# EAGLE board MDCBoard (EAGLE 9.6.2), part 1 of 2
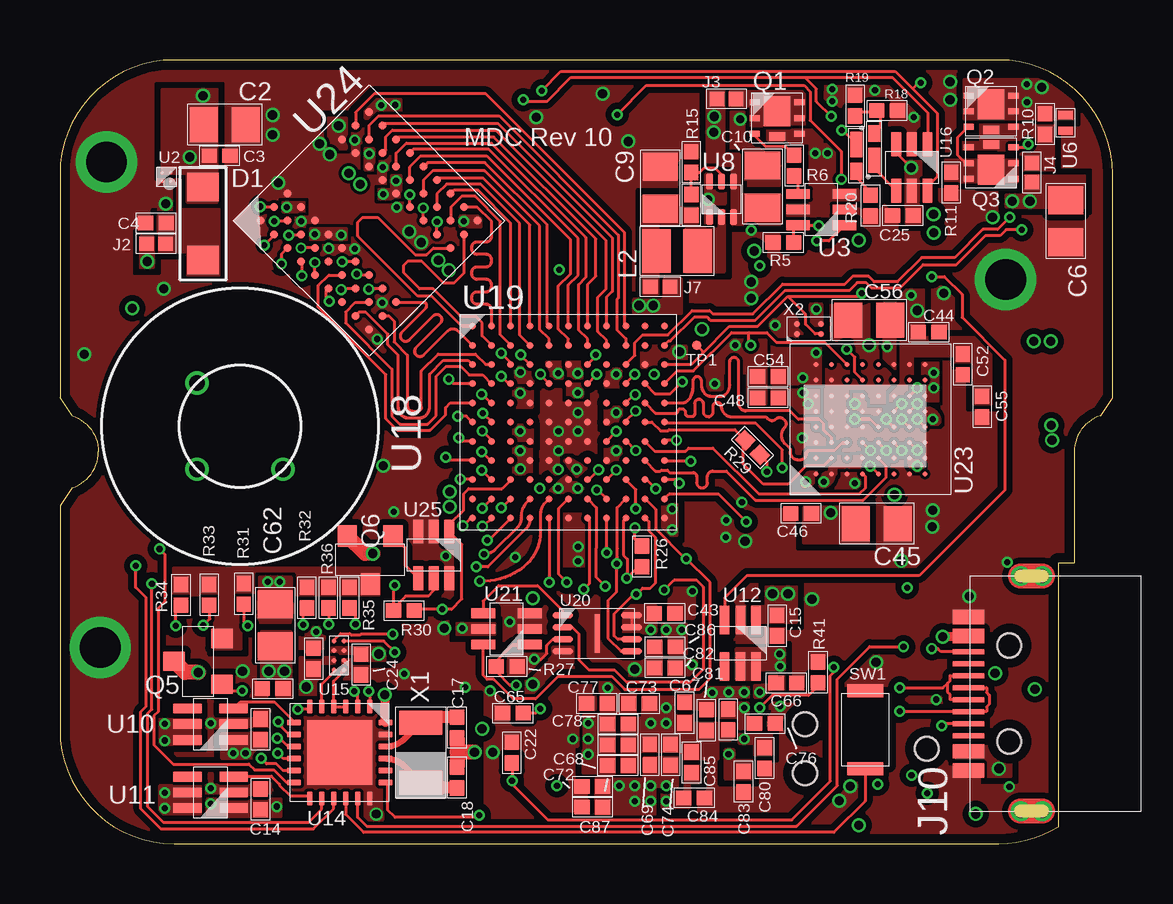
[diagram p12: board, top side]
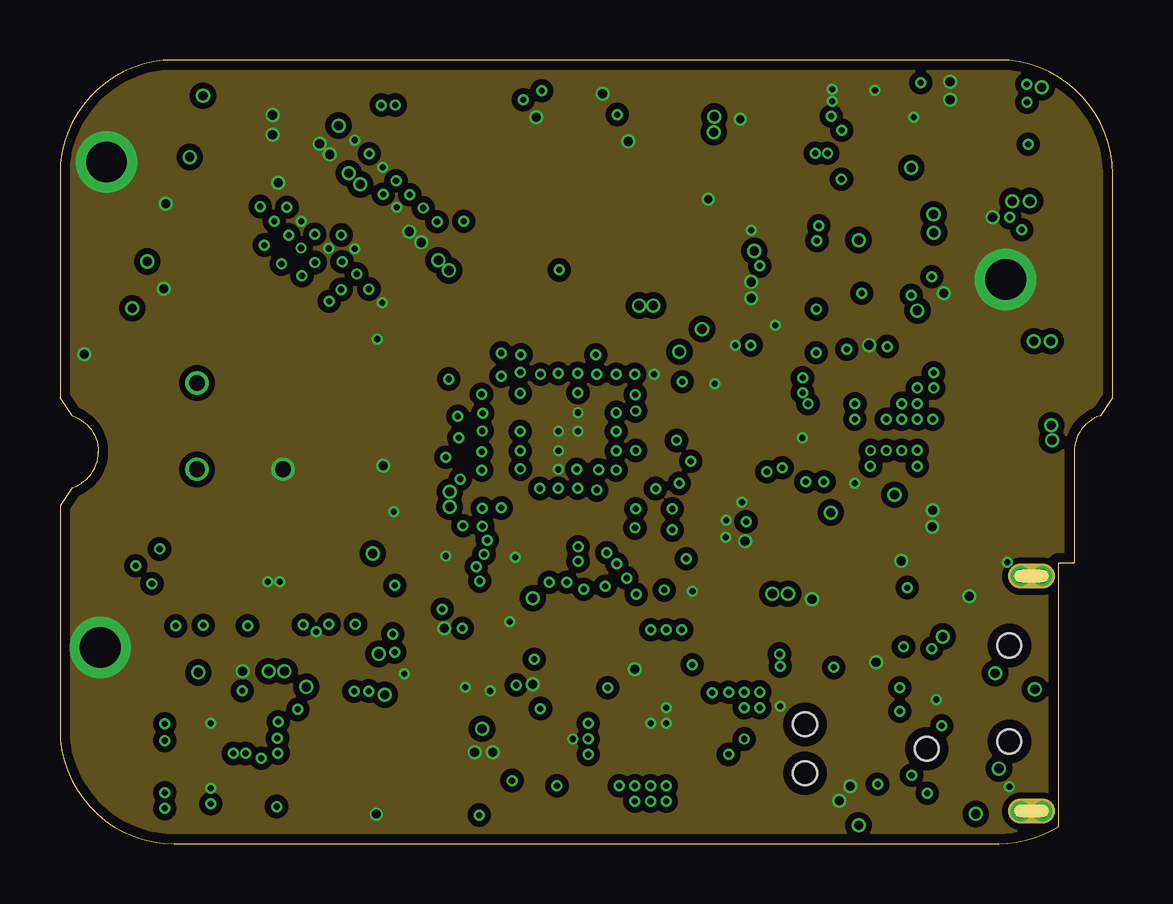
[diagram p13: board, inner layer Ground]
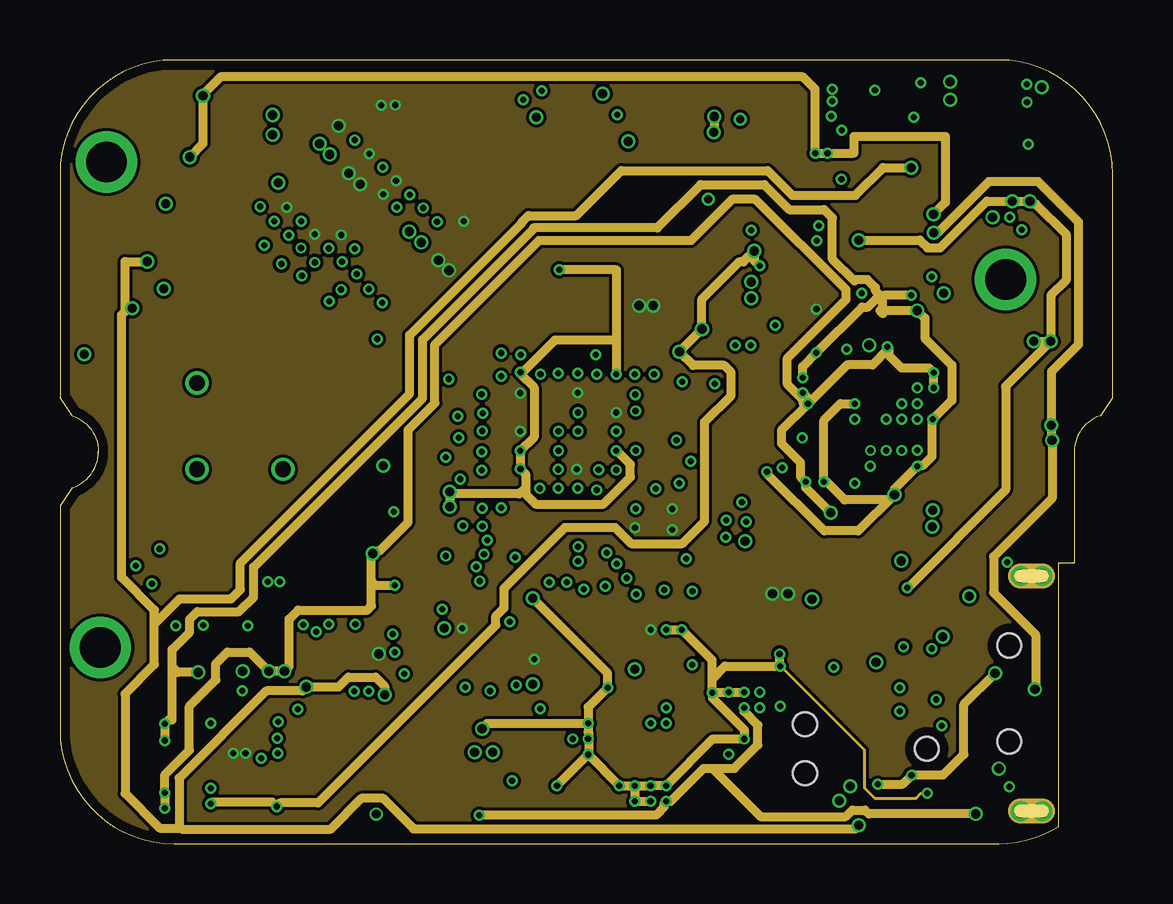
[diagram p14: board, inner layer Power]
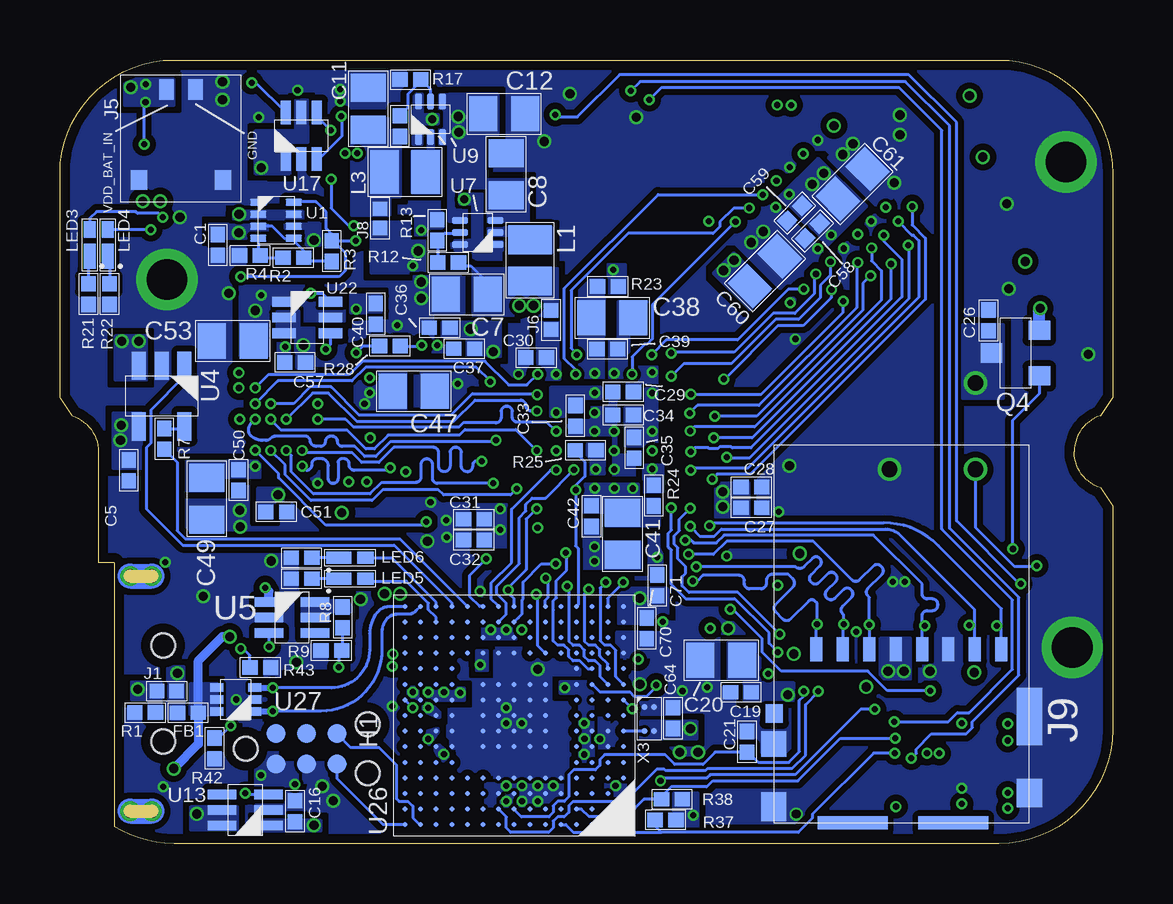
[diagram p15: board, bottom side, seen from below]

Size 43.85 x 32.65 mm. Coordinates in mm from the lower left corner, seen from the top.
Outline: 0,18.57 0,27.9 arc-90 4.75,32.65 39.1,32.65 arc-90 43.85,27.9 43.85,18.57
Outline: 0,14.07 0,4.75 arc90 4.75,0 39.1,0 arc32 41.6,0.71 41.6,0.8
Outline: 42.26,16.32 42.26,11.7 41.6,11.7
Copper layers (1*2*15*16): Top 0.035559375mm / dielectric 0.17018125mm / Ground 0.01778125mm / dielectric 47mil / Power 0.01778125mm / dielectric 0.17018125mm / Bottom 0.035559375mm
Design rules "DRC-Generic-4Layer": minimum track width 5mil, minimum drill 10mil, track to track 5mil, track to pad 6mil, pad to pad 6mil, via to via 6mil, smd to smd 5mil, copper to edge 16mil, drill to drill 6mil, minimum pad ring 4mil, minimum via ring 4mil, stop-mask expansion 2.5mil, vias tented up to drill 25mil, thermal gap 10mil
tKeepout: area 26.9,10.8 to 40.2,24; area 31.7,3 to 35.3,6.5

## Footprints (pad centres in the part's own frame; a part is rotated, then mirrored left to right if it is on the bottom)
0402 = smd 0.635 x 0.6: 1 -0.432,0; 2 0.432,0
0805 = smd 1.165 x 1.465: 1 -0.875,0; 2 0.875,0
ROHM-SOD-123FL = smd 1.195 x 1.312: A 1.525,0; C -1.525,0
TAGCONNECT-TC2030-NL = smd 0.787 x 0.787: 1 -1.27,-0.635; 2 -1.27,0.635; 3 0,-0.635; 4 0,0.635; 5 1.27,-0.635; 6 1.27,0.635 | hole 0.991: -2.54,0; 2.54,1.016; 2.54,-1.016
JUMPER-SOLDER-CLOSED = smd 0.6 x 0.6: 1 -0.4,0; 2 0.4,0
MOLEX-781710002 = smd 0.6 x 0.85: 1 -0.6,0; 2 0.6,0 | smd 0.7 x 0.8: 3 1.75,-3.775; 4 -1.75,-3.775
MOLEX-1051620001 = smd 0.5 x 1: CLK -0.85,0.632; CMD 1.35,0.632; DAT0 -3.05,0.632; DAT1 -4.15,0.632; DAT2 3.55,0.632; DAT3 2.45,0.632; VDD 0.25,0.632; VSS -1.95,0.632 | smd 0.72 x 0.78: DET 5.31,3.312 | smd 1.05 x 1.08: GND1 5.325,4.582 | smd 1.05 x 1.2: GND2 5.325,7.192; GND3 -5.325,6.622 | smd 1.05 x 2.39: GND4 -5.325,3.438 | smd 2.91 x 0.55: NC1 -2.145,7.867; NC2 2.045,7.867
GSWITCH-GT-USB-7030A = smd 0.2 x 1.3: A5 1.25,-3.85; A6 0.25,-3.85; A7 -0.25,-3.85; A8 -1.25,-3.85; B5 -1.75,-3.85; B6 -0.75,-3.85; B7 0.75,-3.85; B8 1.75,-3.85 | smd 0.6 x 1.3: A9B4 -2.4,-3.85; A12B1 -3.2,-3.85; B9A4 2.4,-3.85; B12A1 3.2,-3.85 | drill 0.55: GND1 -4.9,-0.775; GND2 -4.9,-1.675; GND3 4.9,-0.775; GND4 4.9,-1.675 | hole 1: -2,-2.15; 2,-2.15
0806 = smd 1.196 x 1.815: 1 -0.86,0; 2 0.86,0
OSRAM-TOPLED-E1608 = smd 1.05 x 0.5: A 0.325,0 | smd 0.7 x 0.5: C -0.79,0
LED-0603 = smd 0.7 x 0.5: A 0.641,0 | smd 1.05 x 0.5: C -0.475,0
MDC-MOUNT-HOLE = drill 1.7: 1 0,0
NEXPERIA-SOT1220 = smd 0.43 x 0.25: 1 -0.935,0.65; 2 -0.935,0; 3 -0.935,-0.65; 4 0.935,-0.65; 5 0.935,0; 6 0.935,0.65 | smd 1.1 x 1.25: 7 0,0.285 | smd 0.66 x 0.35: 8 0,-0.775
DIODESINC-DMG2305UX = smd 0.9 x 0.8: D 1,0; G -1,0.95; S -1,-0.95
DEALON-TD-1624UR-180 = smd 0.55 x 1.5: 1 -1.625,0; 2 1.625,0
TEST-POINT = smd 0.4 x 0.4: X 0,0
TI-TPS2116DRLR = smd 0.67 x 0.3: 1 -0.74,0.75; 2 -0.74,0.25; 3 -0.74,-0.25; 4 -0.74,-0.75; 5 0.74,-0.75; 6 0.74,-0.25; 7 0.74,0.25; 8 0.74,0.75
DIODESINC-AP7350 = smd 0.15 x 0.15: 1 -0.175,0.175; 2 -0.175,-0.175; 3 0.175,-0.175; 4 0.175,0.175
NEXPERIA-SOT363 = smd 0.988 x 0.41: 1 -0.97,0.65; 2 -0.97,0; 3 -0.97,-0.65; 4 0.97,-0.65; 5 0.97,0; 6 0.97,0.65
MICROCHIP-MIC550X-SOT23-5 = smd 1.186 x 0.584: 1 -1.264,0.95; 2 -1.264,0; 3 -1.264,-0.95; 4 1.264,-0.95; 5 1.264,0.95
TI-TPS22919DCK = smd 1.186 x 0.397: 1 -0.962,0.65; 2 -0.962,0; 3 -0.962,-0.65; 4 0.962,-0.65; 5 0.962,0; 6 0.962,0.65
EATON-STN101 = smd 0.35 x 0.6: 1 -0.325,0; 2 0.325,0
TI-TPS62A01DRLR = smd 0.67 x 0.3: 1 -0.74,0.5; 2 -0.74,0; 3 -0.74,-0.5; 4 0.74,-0.5; 5 0.74,0; 6 0.74,0.5
TI-MSP430FR2433IRGE = smd 0.58 x 0.24: 1 -1.913,1.25; 2 -1.913,0.75; 3 -1.913,0.25; 4 -1.913,-0.25; 5 -1.913,-0.75; 6 -1.913,-1.25; 13 1.913,-1.25; 14 1.913,-0.75; 15 1.913,-0.25; 16 1.913,0.25; 17 1.913,0.75; 18 1.913,1.25 | smd 0.24 x 0.58: 7 -1.25,-1.913; 8 -0.75,-1.913; 9 -0.25,-1.913; 10 0.25,-1.913; 11 0.75,-1.913; 12 1.25,-1.913; 19 1.25,1.913; 20 0.75,1.913; 21 0.25,1.913; 22 -0.25,1.913; 23 -0.75,1.913; 24 -1.25,1.913 | smd 2.7 x 2.7: 25 0,0
NEXPERIA-NXB0102UN = smd 0.2 x 0.2: A1 -0.2,0.6; A2 0.2,0.6; B1 -0.2,0.2; B2 0.2,0.2; C1 -0.2,-0.2; C2 0.2,-0.2; D1 -0.2,-0.6; D2 0.2,-0.6
PANASONIC-EKMB110711X = drill 0.65: 1 2.54,0; 2 0,2.54; 3 -2.54,0
LATTICE-ICE40HX4K-BG121 = smd 0.3 x 0.3: A1 -4,4; A2 -3.2,4; A3 -2.4,4; A4 -1.6,4; A5 -0.8,4; A6 0,4; A7 0.8,4; A8 1.6,4; A9 2.4,4; A10 3.2,4; A11 4,4; B1 -4,3.2; B2 -3.2,3.2; B3 -2.4,3.2; B4 -1.6,3.2; B5 -0.8,3.2; B6 0,3.2; B7 0.8,3.2; B8 1.6,3.2; B9 2.4,3.2; B10 3.2,3.2; B11 4,3.2; C1 -4,2.4; C2 -3.2,2.4; C3 -2.4,2.4; C4 -1.6,2.4; C5 -0.8,2.4; C6 0,2.4; C7 0.8,2.4; C8 1.6,2.4; C9 2.4,2.4; C10 3.2,2.4; C11 4,2.4; D1 -4,1.6; D2 -3.2,1.6; D3 -2.4,1.6; D4 -1.6,1.6; D5 -0.8,1.6; D6 0,1.6; D7 0.8,1.6; D8 1.6,1.6; D9 2.4,1.6; D10 3.2,1.6; D11 4,1.6; E1 -4,0.8; E2 -3.2,0.8; E3 -2.4,0.8; E4 -1.6,0.8; E5 -0.8,0.8; E6 0,0.8; E7 0.8,0.8; E8 1.6,0.8; E9 2.4,0.8; E10 3.2,0.8; E11 4,0.8; F1 -4,0; F2 -3.2,0; F3 -2.4,0; F4 -1.6,0; F5 -0.8,0; F6 0,0; F7 0.8,0; F8 1.6,0; F9 2.4,0; F10 3.2,0; F11 4,0; G1 -4,-0.8; G2 -3.2,-0.8; G3 -2.4,-0.8; G4 -1.6,-0.8; G5 -0.8,-0.8; G6 0,-0.8; G7 0.8,-0.8; G8 1.6,-0.8; G9 2.4,-0.8; G10 3.2,-0.8; G11 4,-0.8; H1 -4,-1.6; H2 -3.2,-1.6; H3 -2.4,-1.6; H4 -1.6,-1.6; H5 -0.8,-1.6; H6 0,-1.6; H7 0.8,-1.6; H8 1.6,-1.6; H9 2.4,-1.6; H10 3.2,-1.6; H11 4,-1.6; J1 -4,-2.4; J2 -3.2,-2.4; J3 -2.4,-2.4; J4 -1.6,-2.4; J5 -0.8,-2.4; J6 0,-2.4; J7 0.8,-2.4; J8 1.6,-2.4; J9 2.4,-2.4; J10 3.2,-2.4; J11 4,-2.4; K1 -4,-3.2; K2 -3.2,-3.2; K3 -2.4,-3.2; K4 -1.6,-3.2; K5 -0.8,-3.2; K6 0,-3.2; K7 0.8,-3.2; K8 1.6,-3.2; K9 2.4,-3.2; K10 3.2,-3.2; K11 4,-3.2; L1 -4,-4; L2 -3.2,-4; L3 -2.4,-4; L4 -1.6,-4; L5 -0.8,-4; L6 0,-4; L7 0.8,-4; L8 1.6,-4; L9 2.4,-4; L10 3.2,-4; L11 4,-4
WINBOND-W25Q40EWUXIE = smd 0.86 x 0.27: 1 -1.435,0.75; 2 -1.435,0.25; 3 -1.435,-0.25; 4 -1.435,-0.75; 5 1.435,-0.75; 6 1.435,-0.25; 7 1.435,0.25; 8 1.435,0.75 | smd 0.2 x 1.6: 9 0,0
ON-AR0330CS1C12SPKA0 = smd 0.2 x 0.2: A1 -1.985,2.045; A2 -1.335,2.045; A3 -0.685,2.045; A4 -0.035,2.045; A5 0.615,2.045; A6 1.265,2.045; A7 1.915,2.045; A8 2.565,2.045; B1 -1.985,1.395; B2 -1.335,1.395; B3 -0.685,1.395; B4 -0.035,1.395; B5 0.615,1.395; B6 1.265,1.395; B7 1.915,1.395; B8 2.565,1.395; C1 -1.985,0.745; C2 -1.335,0.745; C3 -0.685,0.745; C4 -0.035,0.745; C5 0.615,0.745; C6 1.265,0.745; C7 1.915,0.745; C8 2.565,0.745; D1 -1.985,0.095; D2 -1.335,0.095; D3 -0.685,0.095; D4 -0.035,0.095; D5 0.615,0.095; D6 1.265,0.095; D7 1.915,0.095; D8 2.565,0.095; E1 -1.985,-0.555; E2 -1.335,-0.555; E3 -0.685,-0.555; E4 -0.035,-0.555; E5 0.615,-0.555; E6 1.265,-0.555; E7 1.915,-0.555; E8 2.565,-0.555; F1 -1.985,-1.205; F2 -1.335,-1.205; F3 -0.685,-1.205; F4 -0.035,-1.205; F5 0.615,-1.205; F6 1.265,-1.205; F7 1.915,-1.205; F8 2.565,-1.205; G1 -1.985,-1.855; G2 -1.335,-1.855; G3 -0.685,-1.855; G4 -0.035,-1.855; G5 0.615,-1.855; G6 1.265,-1.855; G7 1.915,-1.855; G8 2.565,-1.855; H1 -1.985,-2.505; H2 -1.335,-2.505; H3 -0.685,-2.505; H4 -0.035,-2.505; H5 0.615,-2.505; H6 1.265,-2.505; H7 1.915,-2.505; H8 2.565,-2.505
ALLIANCE-AS4C8M16MSA-6BIN = smd 0.33 x 0.33: A1 -3.2,3.2; A2 -2.4,3.2; A3 -1.6,3.2; A7 1.6,3.2; A8 2.4,3.2; A9 3.2,3.2; B1 -3.2,2.4; B2 -2.4,2.4; B3 -1.6,2.4; B7 1.6,2.4; B8 2.4,2.4; B9 3.2,2.4; C1 -3.2,1.6; C2 -2.4,1.6; C3 -1.6,1.6; C7 1.6,1.6; C8 2.4,1.6; C9 3.2,1.6; D1 -3.2,0.8; D2 -2.4,0.8; D3 -1.6,0.8; D7 1.6,0.8; D8 2.4,0.8; D9 3.2,0.8; E1 -3.2,0; E2 -2.4,0; E3 -1.6,0; E7 1.6,0; E8 2.4,0; E9 3.2,0; F1 -3.2,-0.8; F2 -2.4,-0.8; F3 -1.6,-0.8; F7 1.6,-0.8; F8 2.4,-0.8; F9 3.2,-0.8; G1 -3.2,-1.6; G2 -2.4,-1.6; G3 -1.6,-1.6; G7 1.6,-1.6; G8 2.4,-1.6; G9 3.2,-1.6; H1 -3.2,-2.4; H2 -2.4,-2.4; H3 -1.6,-2.4; H7 1.6,-2.4; H8 2.4,-2.4; H9 3.2,-2.4; J1 -3.2,-3.2; J2 -2.4,-3.2; J3 -1.6,-3.2; J7 1.6,-3.2; J8 2.4,-3.2; J9 3.2,-3.2
STM-STM32F730I8 = smd 0.2 x 0.2: A1 -4.55,4.55; A2 -3.9,4.55; A3 -3.25,4.55; A4 -2.6,4.55; A5 -1.95,4.55; A6 -1.3,4.55; A7 -0.65,4.55; A8 0,4.55; A9 0.65,4.55; A10 1.3,4.55; A11 1.95,4.55; A12 2.6,4.55; A13 3.25,4.55; A14 3.9,4.55; A15 4.55,4.55; B1 -4.55,3.9; B2 -3.9,3.9; B3 -3.25,3.9; B4 -2.6,3.9; B5 -1.95,3.9; B6 -1.3,3.9; B7 -0.65,3.9; B8 0,3.9; B9 0.65,3.9; B10 1.3,3.9; B11 1.95,3.9; B12 2.6,3.9; B13 3.25,3.9; B14 3.9,3.9; B15 4.55,3.9; C1 -4.55,3.25; C2 -3.9,3.25; C3 -3.25,3.25; C4 -2.6,3.25; C5 -1.95,3.25; C6 -1.3,3.25; C7 -0.65,3.25; C8 0,3.25; C9 0.65,3.25; C10 1.3,3.25; C11 1.95,3.25; C12 2.6,3.25; C13 3.25,3.25; C14 3.9,3.25; C15 4.55,3.25; D1 -4.55,2.6; D2 -3.9,2.6; D3 -3.25,2.6; D4 -2.6,2.6; D5 -1.95,2.6; D6 -1.3,2.6; D7 -0.65,2.6; D8 0,2.6; D9 0.65,2.6; D10 1.3,2.6; D11 1.95,2.6; D12 2.6,2.6; D13 3.25,2.6; D14 3.9,2.6; D15 4.55,2.6; E1 -4.55,1.95; E2 -3.9,1.95; E3 -3.25,1.95; E4 -2.6,1.95; E12 2.6,1.95; E13 3.25,1.95; E14 3.9,1.95; E15 4.55,1.95; F1 -4.55,1.3; F2 -3.9,1.3; F3 -3.25,1.3; F4 -2.6,1.3; F6 -1.3,1.3; F7 -0.65,1.3; F8 0,1.3; F9 0.65,1.3; F10 1.3,1.3; F12 2.6,1.3; F13 3.25,1.3; F14 3.9,1.3; F15 4.55,1.3; G1 -4.55,0.65; G2 -3.9,0.65; G3 -3.25,0.65; G4 -2.6,0.65; G6 -1.3,0.65; G7 -0.65,0.65; G8 0,0.65; G9 0.65,0.65; G10 1.3,0.65; G12 2.6,0.65; G13 3.25,0.65; G14 3.9,0.65; G15 4.55,0.65; H1 -4.55,0; H2 -3.9,0; H3 -3.25,0; H4 -2.6,0; H6 -1.3,0; H7 -0.65,0; H8 0,0; H9 0.65,0; H10 1.3,0; H12 2.6,0; H13 3.25,0; H14 3.9,0; H15 4.55,0; J1 -4.55,-0.65; J2 -3.9,-0.65; J3 -3.25,-0.65; J4 -2.6,-0.65; J6 -1.3,-0.65; J7 -0.65,-0.65; J8 0,-0.65; J9 0.65,-0.65; J10 1.3,-0.65; J12 2.6,-0.65; J13 3.25,-0.65; J14 3.9,-0.65; J15 4.55,-0.65; K1 -4.55,-1.3; K2 -3.9,-1.3; K3 -3.25,-1.3; K4 -2.6,-1.3; K6 -1.3,-1.3; K7 -0.65,-1.3; K8 0,-1.3; K9 0.65,-1.3; K10 1.3,-1.3; K12 2.6,-1.3; K13 3.25,-1.3; K14 3.9,-1.3; K15 4.55,-1.3; L1 -4.55,-1.95; L2 -3.9,-1.95; L3 -3.25,-1.95; L4 -2.6,-1.95; L12 2.6,-1.95; L13 3.25,-1.95; L14 3.9,-1.95; L15 4.55,-1.95; M1 -4.55,-2.6; M2 -3.9,-2.6; M3 -3.25,-2.6; M4 -2.6,-2.6; M5 -1.95,-2.6; M6 -1.3,-2.6; M7 -0.65,-2.6; M8 0,-2.6; M9 0.65,-2.6; M10 1.3,-2.6; M11 1.95,-2.6; M12 2.6,-2.6; M13 3.25,-2.6; M14 3.9,-2.6; M15 4.55,-2.6; N1 -4.55,-3.25; N2 -3.9,-3.25; N3 -3.25,-3.25; N4 -2.6,-3.25; N5 -1.95,-3.25; N6 -1.3,-3.25; N7 -0.65,-3.25; N8 0,-3.25; N9 0.65,-3.25; N10 1.3,-3.25; N11 1.95,-3.25; N12 2.6,-3.25; N13 3.25,-3.25; N14 3.9,-3.25; N15 4.55,-3.25; P1 -4.55,-3.9; P2 -3.9,-3.9; P3 -3.25,-3.9; P4 -2.6,-3.9; P5 -1.95,-3.9; P6 -1.3,-3.9; P7 -0.65,-3.9; P8 0,-3.9; P9 0.65,-3.9; P10 1.3,-3.9; P11 1.95,-3.9; P12 2.6,-3.9; P13 3.25,-3.9; P14 3.9,-3.9; P15 4.55,-3.9; R1 -4.55,-4.55; R2 -3.9,-4.55; R3 -3.25,-4.55; R4 -2.6,-4.55; R5 -1.95,-4.55; R6 -1.3,-4.55; R7 -0.65,-4.55; R8 0,-4.55; R9 0.65,-4.55; R10 1.3,-4.55; R11 1.95,-4.55; R12 2.6,-4.55; R13 3.25,-4.55; R14 3.9,-4.55; R15 4.55,-4.55
DIODESINC-DT1446-04V-7 = smd 0.546 x 0.337: 1 -0.796,0.5; 2 -0.796,0; 3 -0.796,-0.5; 4 0.796,-0.5; 5 0.796,0; 6 0.796,0.5
EPSON-FC-135 = smd 1 x 1.8: 1 -1.25,0; 2 1.25,0
SITIME-SIT8021 = smd 0.25 x 0.25: 1 -0.205,0.5; 2 -0.205,-0.5; 3 0.205,-0.5; 4 0.205,0.5

## Placement (x,y rotation side)
C1  2.2u  [0402]  37.28,24.94 270 bottom
C2  10u  [0805]  6.86,29.96 0 top
C3  100n  [0402]  6.65,28.66 0 top
C4  100n  [0402]  4,25.86 180 top
C5  2.2u  [0402]  40.99,15.55 270 bottom
C6  10u  [0805]  41.9,25.94 270 top
C7  22u  [0805]  26.91,22.88 180 bottom
C8  10u  [0805]  25.27,27.89 90 bottom
C9  22u  [0805]  25.01,27.32 90 top
C10  10u  [0805]  29.27,27.38 90 top
C11  22u  [0805]  31.01,30.62 90 bottom
C12  10u  [0805]  25.35,30.41 0 bottom
C13  2.2u  [0402]  8.36,4.76 90 top
C14  2.2u  [0402]  8.35,1.85 90 top
C15  2.2u  [0402]  29.88,9.08 270 top
C16  2.2u  [0402]  34.06,1.35 90 bottom
C17  22p  [0402]  16.54,4.83 270 top
C18  22p  [0402]  16.54,2.75 90 top
C19  100n  [0402]  15.48,6.3 180 bottom
C20  10u  [0805]  16.3,7.64 180 bottom
C21  22p  [0402]  15.23,4.24 90 bottom
C22  100n  [0402]  18.82,3.79 90 top
C23  100n  [0402]  10.57,7.7 90 top
C24  100n  [0402]  12.55,7.46 270 top
C25  100n  [0402]  35.12,26.17 180 top
C26  100n  [0402]  5.17,21.8 90 bottom
C27  100n  [0402]  15.05,13.99 0 bottom
C28  10n  [0402]  15.05,14.86 0 bottom
C29  100n  [0402]  20.39,18.82 180 bottom
C30  10n  [0402]  24.01,20.25 180 bottom
C31  100n  [0402]  26.61,13.52 180 bottom
C32  10n  [0402]  26.61,12.65 180 bottom
C33  10n  [0402]  22.38,17.82 270 bottom
C34  100n  [0402]  20.39,17.86 180 bottom
C35  10n  [0402]  19.93,16.49 270 bottom
C36  100n  [0402]  28.04,21.49 180 bottom
C37  10n  [0402]  27.01,20.62 180 bottom
C38  10u  [0805]  20.85,21.91 0 bottom
C39  100n  [0402]  21.04,20.6 0 bottom
C40  10n  [0402]  30.7,22.08 270 bottom
C41  10u  [0805]  20.41,12.9 270 bottom
C42  100n  [0402]  21.71,13.64 270 bottom
C43  100n  [0402]  25.19,9.6 0 top
C44  100n  [0402]  36.2,21.31 0 top
C45  10u  [0805]  34.03,13.33 0 top
C46  100n  [0402]  30.88,13.76 180 top
C47  10u  [0805]  29.11,18.85 0 bottom
C48  100n  [0402]  29.5,18.57 180 top
C49  10u  [0805]  37.74,14.38 270 bottom
C50  100n  [0402]  36.41,15.15 270 bottom
C51  100n  [0402]  34.84,13.82 0 bottom
C52  100n  [0402]  37.61,19.97 270 top
C53  10u  [0805]  36.66,20.94 180 bottom
C54  100n  [0402]  29.5,19.46 180 top
C55  100n  [0402]  38.42,18.2 270 top
C56  10u  [0805]  33.72,21.81 180 top
C57  100n  [0402]  34.06,20.05 0 bottom
C58  100n  [0402]  12.5,25.53 225 bottom
C59  100n  [0402]  13.24,26.27 225 bottom
C60  10u  [0805]  14.48,23.85 45 bottom
C61  10u  [0805]  10.83,27.49 45 bottom
C62  10u  [0805]  8.97,9.09 90 top
C63  100n  [0402]  8.86,6.46 180 top
C64  10n  [0402]  18.31,5.22 90 bottom
C65  100n  [0402]  18.87,5.43 180 top
C66  2.2u  [0402]  30.26,6.69 0 top
C67  100n  [0402]  26.02,5.46 270 top
C68  100n  [0402]  23.24,3.26 0 top
C69  100n  [0402]  24.57,3.71 90 top
C70  100n  [0402]  19.41,8.97 270 bottom
C71  2.2u  [0402]  18.97,10.76 90 bottom
C72  100n  [0402]  22.18,2.38 180 top
C73  100n  [0402]  24.13,5.84 0 top
C74  100n  [0402]  25.45,3.7 90 top
C75  100n  [0402]  27.84,5.17 270 top
C76  2.2u  [0402]  29.37,5 0 top
C77  100n  [0402]  22.37,5.84 180 top
C78  100n  [0402]  23.25,4.98 0 top
C79  100n  [0402]  23.25,4.12 0 top
C80  100n  [0402]  29.35,3.56 270 top
C81  100n  [0402]  26.93,5.14 270 top
C82  2.2u  [0402]  25.21,7.32 180 top
C83  2.2u  [0402]  28.48,2.59 270 top
C84  100n  [0402]  26.43,1.91 0 top
C85  2.2u  [0402]  26.31,3.38 90 top
C86  2.2u  [0402]  25.21,8.2 180 top
C87  2.2u  [0402]  22.18,1.52 180 top
D1  ROHM-RB168MM-40  [ROHM-SOD-123FL]  5.96,25.84 270 top
FB1  FERRITE-BEAD0402  [0402]  38.52,5.45 180 bottom
H1  TAGCONNECT-TC2030-NL  [TAGCONNECT-TC2030-NL]  33.58,3.95 0 bottom
J1  JUMPER-SOLDER-CLOSED  [JUMPER-SOLDER-CLOSED]  39.41,6.35 180 bottom
J2  JUMPER-SOLDER-CLOSED  [JUMPER-SOLDER-CLOSED]  4,24.99 180 top
J3  JUMPER-SOLDER-CLOSED  [JUMPER-SOLDER-CLOSED]  27.77,31.03 180 top
J4  JUMPER-SOLDER-CLOSED  [JUMPER-SOLDER-CLOSED]  40.49,27.96 90 top
J5  BATTERY-HEADER-MOLEX-781710002  [MOLEX-781710002]  38.81,31.43 0 bottom
J6  JUMPER-SOLDER-CLOSED  [JUMPER-SOLDER-CLOSED]  23.4,21.82 270 bottom
J7  JUMPER-SOLDER-CLOSED  [JUMPER-SOLDER-CLOSED]  25.01,23.2 0 top
J8  JUMPER-SOLDER-CLOSED  [JUMPER-SOLDER-CLOSED]  30.52,26.05 270 bottom
J9  MICROSD-SOCKET  [MOLEX-1051620001]  8.78,8.73 180 bottom
J10  USB-C-RECEPTACLE-GSWITCH-7030A  [GSWITCH-GT-USB-7030A]  41.7,6.25 270 top
L1  1u  [0806]  24.26,24.3 270 bottom
L2  1u  [0806]  25.71,24.69 180 top
L3  1u  [0806]  29.48,27.99 180 bottom
LED1  LEDOSRAM-TOPLED-E1608  [OSRAM-TOPLED-E1608]  33.92,28.8 270 top
LED2  LEDOSRAM-TOPLED-E1608  [OSRAM-TOPLED-E1608]  33.17,28.8 90 top
LED3  LEDLED-0603  [LED-0603]  42.62,24.95 90 bottom
LED4  LEDLED-0603  [LED-0603]  41.86,24.95 90 bottom
LED5  LEDLED-0603  [LED-0603]  31.77,11.03 0 bottom
LED6  LEDLED-0603  [LED-0603]  31.77,11.91 0 bottom
MH1  MDC-MOUNT-HOLE  [MDC-MOUNT-HOLE]  1.94,28.4 0 top
MH2  MDC-MOUNT-HOLE  [MDC-MOUNT-HOLE]  1.68,8.17 0 top
MH3  MDC-MOUNT-HOLE  [MDC-MOUNT-HOLE]  39.4,23.5 0 top
MH4  MDC-CUTOUT-HALF  [MDC-CUTOUT-HALF]  43.85,16.32 0 bottom
MH5  MDC-CUTOUT-HALF  [MDC-CUTOUT-HALF]  0,16.32 0 top
MH6  MDC-CUTOUT-HALF  [MDC-CUTOUT-HALF]  0,16.32 180 bottom
Q1  PMOS-NEXPERIA-SOT1220  [NEXPERIA-SOT1220]  29.88,30.23 0 top
Q2  PMOS-NEXPERIA-SOT1220  [NEXPERIA-SOT1220]  38.8,30.51 0 top
Q3  PMOS-NEXPERIA-SOT1220  [NEXPERIA-SOT1220]  38.8,28.35 180 top
Q4  DIODESINC-DMG2305UX  [DIODESINC-DMG2305UX]  4.05,20.44 180 bottom
Q5  DIODESINC-DMG2305UX  [DIODESINC-DMG2305UX]  5.75,7.59 180 top
Q6  DIODESINC-DMG2305UX  [DIODESINC-DMG2305UX]  12.92,11.82 270 top
R1  100k  [0402]  40.31,5.46 180 bottom
R2  300k  [0402]  34.13,24.41 180 bottom
R3  10k  [0402]  32.53,24.69 90 bottom
R4  100k  [0402]  35.94,24.5 180 bottom
R5  100k  [0402]  30.14,25.04 180 top
R6  365k  [0402]  30.59,28.25 270 top
R7  2.7k  [0402]  39.51,16.87 90 bottom
R8  1k  [0402]  32.08,9.43 270 bottom
R9  3k  [0402]  32.55,8.04 180 bottom
R10  100k  [0402]  41.04,29.98 270 top
R11  100k  [0402]  37.13,27.54 270 top
R12  100k  [0402]  27.68,24.21 180 bottom
R13  100k  [0402]  28.14,25.56 90 bottom
R14  200k  [0402]  26.31,26.62 90 top
R15  100k  [0402]  26.3,28.4 90 top
R16  365k  [0402]  29.69,29.9 90 bottom
R17  100k  [0402]  29.25,31.83 180 bottom
R18  100  [0402]  34.46,30.55 180 top
R19  100  [0402]  33.13,30.75 270 top
R20  100  [0402]  33.77,26.59 90 top
R21  1k  [0402]  42.67,22.9 270 bottom
R22  1k  [0402]  41.79,22.9 270 bottom
R23  100  [0402]  21.03,23.21 0 bottom
R24  100  [0402]  19.12,14.5 90 bottom
R25  10k  [0402]  21.96,16.39 180 bottom
R26  10k  [0402]  24.25,11.96 270 top
R27  10k  [0402]  18.61,7.38 0 top
R28  10k  [0402]  30.11,20.73 180 bottom
R29  10k  [0402]  28.86,16.51 135 top
R30  10k  [0402]  14.33,9.71 180 top
R31  20k  [0402]  7.66,10.4 90 top
R32  20k  [0402]  10.28,10.24 90 top
R33  20k  [0402]  6.21,10.37 90 top
R34  20k  [0402]  5.04,10.36 90 top
R35  20k  [0402]  12.06,10.25 90 top
R36  20k  [0402]  11.18,10.25 90 top
R37  10k  [0402]  18.63,0.99 0 bottom
R38  10k  [0402]  18.36,1.85 0 bottom
R39  1k  [0402]  33.79,11.03 180 bottom
R40  1k  [0402]  33.79,11.91 180 bottom
R41  3k  [0402]  31.59,7.14 270 top
R42  5.1k  [0402]  37.41,3.97 270 bottom
R43  5.1k  [0402]  35.51,7.33 0 bottom
SW1  TACTILE-SWITCH  [DEALON-TD-1624UR-180]  33.54,4.75 90 top
TP1  TEST-POINT  [TEST-POINT]  26.52,20.77 0 top
U1  TI-TPS2116  [TI-TPS2116DRLR]  34.85,25.97 0 bottom
U2  DIODESINC-AP7350  [DIODESINC-AP7350]  4.44,27.78 0 top
U3  NEXPERIA-74LVC1G98-NOR  [NEXPERIA-SOT363]  31.72,26.42 180 top
U4  MICROCHIP-MCP7383X  [MICROCHIP-MIC550X-SOT23-5]  39.62,18.65 270 bottom
U5  TI-TPS22919DCK  [TI-TPS22919DCK]  34.19,9.42 0 bottom
U6  EATON-STN101  [EATON-STN101]  41.9,30.03 270 top
U7  TI-TPS62A01  [TI-TPS62A01DRLR]  26.45,25.46 180 bottom
U8  TI-TPS62A01  [TI-TPS62A01DRLR]  27.57,26.85 90 top
U9  TI-TPS62A01  [TI-TPS62A01DRLR]  28.42,30.18 90 bottom
U10  TI-TPS22919DCK  [TI-TPS22919DCK]  6.27,4.97 180 top
U11  TI-TPS22919DCK  [TI-TPS22919DCK]  6.28,2.14 180 top
U12  TI-TPS22919DCK  [TI-TPS22919DCK]  28.35,8.35 270 top
U13  TI-TPS22919DCK  [TI-TPS22919DCK]  36.14,1.4 180 bottom
U14  TI-MSP430FR2433IRGE  [TI-MSP430FR2433IRGE]  11.65,3.79 270 top
U15  NEXPERIA-NXB0102  [NEXPERIA-NXB0102UN]  11.62,7.84 180 top
U16  NEXPERIA-74LVC1G98-MUX-INV-OUTPUT  [NEXPERIA-SOT363]  35.5,28.17 270 top
U17  NEXPERIA-74LVC1G98-MUX-INV-OUTPUT  [NEXPERIA-SOT363]  33.8,29.49 90 bottom
U18  PANASONIC-EKMB110711X  [PANASONIC-EKMB110711X]  7.5,17.39 135 top
U19  LATTICE-ICE40HX4K-BG121  [LATTICE-ICE40HX4K-BG121]  21.18,17.56 0 top
U20  WINBOND-W25Q40EW  [WINBOND-W25Q40EWUXIE]  22.38,8.76 0 top
U21  NEXPERIA-74LVC1G98-OR-INV-INPUT  [NEXPERIA-SOT363]  18.61,8.94 180 top
U22  NEXPERIA-74LVC1G98-BUFFER  [NEXPERIA-SOT363]  33.55,21.92 0 bottom
U23  ON-AR0330CS1C12SPKA0  [ON-AR0330CS1C12SPKA0]  33.54,17.39 90 top
U24  ALLIANCE-AS4C8M16MSA-6BIN  [ALLIANCE-AS4C8M16MSA-6BIN]  12.88,25.95 45 top
U25  NEXPERIA-74LVC1G98-INVERTER  [NEXPERIA-SOT363]  15.57,12.03 270 top
U26  STM-STM32F730  [STM-STM32F730I8]  24.93,5.34 180 bottom
U27  DIODESINC-DT1446-04V-7  [DIODESINC-DT1446-04V-7]  36.53,6 180 bottom
X1  EPSON-FC-135  [EPSON-FC-135]  15.03,3.79 90 top
X2  SITIME-SIT8021  [SITIME-SIT8021]  31.2,21.44 90 top
X3  SITIME-SIT8021  [SITIME-SIT8021]  19.3,5.2 0 bottom

## Tracks (layer width: path | path; a pad name or v marks a point on that pad's centre or on a via)
BAT_CHRG_EN_
  Bottom 0.127: U26.R11 29.68,12.69 38.62,12.69 38.98,13.04 38.98,15.9 R7.1
BAT_CHRG_LVL  (via drill 0.25)
  Top 0.127: U14.6 10.29,5.59 v9.9,5.59 | C22.1 18.83,3.35 v18.83,2.63 v18.83,2.62 18.83,2.48 20.32,0.99 30.49,0.99 32.1,2.6 32.1,7 32.24,7.14 v32.24,7.34
  Bottom 0.127: v9.9,5.59 10.49,5.59 13.21,2.88 16.76,2.88 16.9,2.74 18.72,2.74 v18.83,2.63 | R8.2 32.08,8.08 R9.1 32.24,7.92 v32.24,7.34
BAT_CHRG_LVL_EN  (via drill 0.25)
  Top 0.127: U14.17 12.4,1.09 12.77,0.72 30.7,0.72 32.39,2.42 32.39,6.86 33.73,8.2 v35.15,8.2
  Bottom 0.127: U5.3 v35.15,8.21 v35.15,8.2
BAT_CHRG_STAT
  Bottom 0.127: U4.1 38.67,19.47 40.06,18.07 40.06,16.7 40.25,16.51 40.25,13.94 38.74,12.43 29.94,12.43 27.53,10.03 U26.R12
BUTTON_SIGNAL_
  Top 0.127: U14.16 11.9,1.22 12.65,0.47 32.24,0.47 33.54,1.77 SW1.1
GND  (via drill 0.25, 0.33, 0.36, 0.38, 0.38 pad 0.38)
  Top 0.635: C17.2 16.54,3.81 | 16.54,3.81 C18.2 | v17.27,3.81 16.54,3.81
  other vias: 21.58,17.96 21.58,17.17 20.77,17.17 20.77,16.36 25.26,5.01 25.25,5.66 24.61,5.01 21.36,4.36 10.81,29.16 11.24,28.71 14.56,25.5 15.06,25.05 9.09,27.53 10.06,25.93 11.2,24.8 12.29,29.32 13.45,28.17 12.29,24.78 14.04,26.52 7.61,7.18 19.69,6.63 23.95,7.27 27.76,13.47 27.75,12.76 20.77,15.59 13.43,22.54 28.54,12.6 26.35,10.51 27.01,26.85 28.42,14.22 6.28,5.01 6.28,2.3 27.28,19.16 17.92,6.36 33.11,15.01 28.14,20.77 24.75,19.56 23.67,29.26 36.36,13.89 30.93,16.9 39.56,2.36 10.68,8.82 29.8,21.6 18.03,3.81 8.66,10.91 9.16,10.91 4.4,26.65 37.88,10.3 28.8,25.56 39.47,11.72 36.82,22.93 28.34,30.18 33.71,20.77 28.8,23.4 14.35,7.08 16,8.97 16.07,11.98 13.91,13.83 18.74,9.25 18.97,11.93 13.21,21.02 8.86,30.36 8.86,29.53 30.01,5.72 37.08,30.99 37.08,31.75 19.85,30.27 13.46,15.75 4.32,23.11 16.89,6.52 13.18,1.22 35.58,30.26 33.96,31.38 32.17,31.43 32.17,30.93 28.8,22.73 22.61,31.24 1.02,20.39 36.52,6 36.34,13.2 31.33,10.18 38.86,26.1 32.92,2.38 32.47,1.78 35.05,11.78 34,7.55
  pour Ground (isolate 0.254, rank 6, no thermals): -2.64,35.56 -2.64,-3.1 47.38,-3.1 47.38,35.56
  pour Top (rank 2, no thermals): 20.14,18.91 20.14,15.87 20.6,15.41 20.75,15.41 21.85,16.51 22.07,16.51 22.19,16.64 22.19,18.35 20.87,18.35 20.87,18.91
  pour Top (isolate 0.254, rank 6, no thermals): -1.91,34.65 -1.91,-2.1 46.51,-2.1 46.51,34.65
  pour Bottom (isolate 0.254, rank 6, no thermals): -3.58,36.53 -3.58,-3.91 48.32,-3.91 48.32,36.53
  pour Bottom (no thermals): 26.77,13.79 26.77,12.38 28.06,12.38 28.06,13.79
  pour Bottom (no thermals): 8.6,27.46 9.67,26.39 11.86,28.58 10.79,29.65
  pour Bottom (no thermals): 12.07,24.7 13.76,23.01 15.77,25.02 14.08,26.71
  pour Top (rank 2, no thermals): 7.05,25.71 12.9,19.86 18.75,25.7 12.89,31.56
  pour Top (rank 3, no thermals): 30.44,14.53 37.11,14.53 37.11,20.85 30.44,20.85
  pour Top: 33.82,19.21 arc90 33.57,18.95 arc90 33.97,18.55 34.17,18.55 34.17,18.86 arc90
  pour Top (rank 3, no thermals): 4.1,26.37 4.72,26.37 4.72,27.73 4.1,27.73
  pour Bottom (no thermals): 18.05,5.97 18.05,5.37 19.65,5.37 19.65,5.97
  pour Top (rank 2, no thermals): 20.41,8.18 20.41,8.03 19.4,7.01 19.4,6.25 20.16,6.25 20.16,6.76 20.92,7.52 21.39,7.52 21.39,8.18
  pour Bottom (rank 2, no thermals): 24.73,8.04 24.73,6.51 25.75,6.51 25.75,8.04
  pour Bottom (rank 3, no thermals): 22.7,4.23 22.7,2.69 25.75,2.69 25.75,4.23
  pour Top (no thermals): 24.48,8.41 24.48,7.54 23.72,7.54 23.72,7.01 25.07,7.01 25.07,8.41
  pour Bottom (no thermals): 19.14,8.8 20.67,8.8 20.67,7.78 19.14,7.78
  pour Bottom (no thermals): 22.19,7.53 22.19,7.02 24.23,7.02 24.23,7.53
  pour Bottom (rank 2, no thermals): 20.98,5.24 20.98,3.97 21.54,3.97 21.54,5.24
  pour Top (no thermals): 25.37,10.63 25.37,9.4 26.42,9.4 26.42,10.63
  pour Top (rank 2, no thermals): 6.12,5.17 6.12,4.82 8.67,4.82 8.67,5.5 8.11,5.5 8.11,5.17
  pour Top (rank 2, no thermals): 6.12,2.45 7.99,2.45 7.99,2.58 8.75,2.58 8.75,2.03 6.12,2.03
  pour Bottom (no thermals): 26.97,19.66 26.97,18.15 28.8,18.15 28.8,19.66
  pour Top (no thermals): 11.77,7.68 12.85,7.68 12.85,6.75 12.28,6.75 12.28,6.86 11.77,6.86
  pour Top (rank 2, no thermals): 23.4,5.22 23.4,2.96 24.1,2.96 24.1,3.85 25.92,3.85 25.92,3.54 27.43,3.54 27.43,4.39 28.12,4.39 28.12,5.02 26.38,5.02 26.38,5.33 25.62,5.33 25.62,6.1 24.26,6.1 24.26,5.22
  pour Bottom (no thermals): 29.14,31.24 28.76,31.24 28.76,30.39 28.09,30.39 28.09,29.98 28.78,29.98 28.78,29.13 29.14,29.13
  pour Bottom (rank 2, no thermals): 36.98,6.85 35.49,6.85 35.49,5.07 36.98,5.07
  pour Bottom (no thermals): 27.15,23.62 29.12,23.62 29.12,22.1 27.15,22.1
  pour Bottom (no thermals): 25.42,25.08 26.26,25.08 26.26,27.06 27.21,27.06 27.21,26.67 26.67,26.67 26.67,25.15 27.4,25.15 27.4,24.72 25.42,24.72
  pour Top (no thermals): 26.88,27.88 26.88,25.87 27.18,25.87 27.18,26.67 27.74,26.67 27.74,27.18 27.16,27.18 27.16,27.88
  pour Bottom (no thermals): 27.91,26.3 27.91,25.34 29.04,25.34 29.04,26.3
  pour Bottom (no thermals): 26.13,5.6 27.6,5.6 27.6,3.97 26.13,3.97
  pour Top (no thermals): 29.4,21 29.4,18.3 28.7,18.3 28.7,19.6 27.6,19.6 27.6,18.9 26.9,18.9 26.9,21
  pour Bottom (no thermals): 35.7,1.62 34.43,1.62 34.43,2.12 33.67,2.12 33.67,1.24 35.7,1.24
  pour Top (no thermals): 10.23,8.99 10.23,8 10.85,8 10.85,8.99
  pour Top: 29.58,21.82 29.58,21.08 30.73,21.08 30.73,21.82
  pour Bottom (no thermals): 6.6,8.64 6.6,6.86 7.87,6.86 7.87,7.45 7.11,7.45 7.11,8.64
  pour Top (no thermals): 8.3,11.1 8.3,9.4 9.65,9.4 9.65,11.1
  pour Top (rank 2, no thermals): 7.37,7.37 7.37,6.1 8.64,6.1 8.64,7.37
  pour Top (rank 2, no thermals): 28.19,9.91 28.19,8.38 30.23,8.38 30.23,8.95 28.56,8.95 28.56,9.91
  pour Top (no thermals): 22.35,6.1 21.08,6.1 21.08,4.06 21.59,4.06 21.59,5.59 22.35,5.59
  pour Top (rank 2, no thermals): 27.94,30.48 27.94,28.96 28.45,28.96 28.45,27.69 29.97,27.69 29.97,28.96 28.52,28.96 28.52,30.48
  pour Bottom (no thermals): 33.9,22.2 33.9,21.5 33.27,21.5 33.27,19.81 34.04,19.81 34.04,21.08 34.8,21.08 34.8,22.2
  pour Top (no thermals): 9.65,5.84 9.65,1.78 13.72,1.78 13.72,5.84
  pour Top: 29.5,5.84 29.5,4.79 30.24,4.79 30.24,5.84
  pour Top (no thermals): 12.69,2.13 12.69,1 13.46,1 13.46,2.13
  pour Bottom (no thermals): 37.34,27.58 35.28,27.58 35.28,26.63 37.34,26.63
  pour Bottom (no thermals): 32.77,3.81 32.77,2.54 33.7,2.54 33.7,3.81
GNDPLL0  (via drill 0.25)
  other vias: 21.58,12.37 21.58,11.77
  pour Bottom (no thermals): 19.69,12.6 19.69,11.45 22.02,11.45 22.02,13.51 21.43,13.51 21.43,12.6
  pour Top (no thermals): 20.92,13.72 20.92,11.59 21.86,11.59 21.86,13.72
GNDPLL1  (via drill 0.25)
  other vias: 20.76,19.59
  pour Top (rank 4, no thermals): 20.27,20.06 20.27,19.39 20.94,19.39 20.94,20.06
  pour Bottom (no thermals): 19.4,22.61 19.4,21.24 20.16,21.24 20.16,19.4 20.95,19.4 20.95,20.98 20.59,20.98 20.59,22.61
ICE_CDONE  (via drill 0.25)
  Top 0.127: U19.K8 22.41,14.73 v22.37,14.73
  Bottom 0.127: U26.R4 22.27,9.95 22.27,12.3 22.37,12.4 v22.37,14.73 22.37,14.92 21.99,15.3 21.99,15.91 22.39,16.31 R25.2
ICE_CRST_  (via drill 0.25)
  Top 0.127: U19.L9 23.48,13.46 23.48,12.02 23.64,11.85 23.64,11.09 v23.62,11.06 24.06,11.5 24.22,11.5 R26.2
  Bottom 0.127: U26.R6 23.63,10.15 23.54,10.24 23.54,10.98 v23.62,11.06
ICE_IMG_CLK16MHZ  (via drill 0.25)
  Top 0.127: U19.C11 26.3,19.96 26.78,20.44 | TP1.X 26.78,20.51 26.78,20.44 | X2.2 31.46,21.24 31.07,21.63 31.07,22.06 30.33,22.8 | 30.33,22.8 29.07,21.55 27.89,21.55 26.78,20.44 | v33.4,22.93 33.27,22.8 30.33,22.8
  Bottom 0.127: v33.4,22.93 32.92,22.93 32.58,22.6 U22.6
ICE_LED0  (via drill 0.25)
  Top 0.127: U19.C9 23.95,20.34 23.95,20.88 24.27,21.2 25.33,21.2 26.34,22.2 27.07,22.2 27.2,22.07 28.87,22.07 30.11,23.31 32.71,23.31 33.03,23.63 33.69,23.63 33.92,23.4 34.89,23.4 35.9,24.41 37.27,24.41 38.45,25.59 39.06,25.59 v39.57,26.09
  Bottom 0.127: v39.57,26.09 39.74,26.26 40.62,26.26 40.7,26.34 42.33,26.34 42.61,26.06 LED3.A
ICE_LED1  (via drill 0.25)
  Top 0.127: v40.08,25.58 39.42,25.58 39.17,25.33 38.56,25.33 37.35,24.12 35.97,24.12 34.99,23.15 33.81,23.15 33.59,23.38 33.22,23.38 32.9,23.06 30.22,23.06 28.97,21.81 27.1,21.81 26.96,21.95 26.44,21.95 25.44,20.94 25.36,20.94 U19.B11
  Bottom 0.127: v40.08,25.58 v40.08,25.59 LED4.A
ICE_MSP_SPI_CLK  (via drill 0.25)
  Top 0.127: U19.K2 v17.59,13.98 v17.59,13.97 | U15.D2 11.42,8.48 11.69,8.75 12.07,8.75 12.13,8.7 12.5,8.7 12.53,8.73 v13.86,8.73
  Bottom 0.127: v13.86,8.73 v13.87,8.73 13.87,8.73 15.61,10.46 17.66,10.46 17.93,10.74 17.93,11.12 17.78,11.27 17.78,11.54 18.11,11.87 18.11,12.32 18.25,12.46 18.25,12.83 18.05,13.04 18.05,13.52 v17.59,13.97
ICE_MSP_SPI_CLK_X
  Top 0.127: U15.A2 11.42,7.16 10.9,6.64 U14.5
ICE_MSP_SPI_DATA  (via drill 0.25)
  Top 0.127: U19.K3 18.4,13.99 v18.38,13.99 | v13.95,7.98 13.95,7.99 13.5,8.44 U15.D1
  Bottom 0.127: v13.95,7.98 14.31,8.34 14.31,8.78 15.74,10.21 17.79,10.21 18.38,10.8 18.38,12.23 18.51,12.36 18.51,12.94 18.38,13.06 v18.38,13.99
ICE_MSP_SPI_DATA_X
  Top 0.127: U14.3 U14.4 11.4,6.77 11.74,7.11 11.74,7.15 U15.A1
ICE_STM_FLASH_EN  (via drill 0.25)
  Top 0.127: U21.1 18.88,8.29 18.2,7.62 18.2,7.4 R27.1 18.18,7.17 18.75,6.61 v19.02,6.61
  Bottom 0.127: U26.K3 21.35,6.31 20.11,6.31 19.92,6.12 19.43,6.12 19.02,6.54 v19.02,6.61
ICE_STM_SPI_CLK  (via drill 0.25)
  Top 0.127: U19.L10 24.53,13.41 24.53,13.03 24.82,12.75 24.82,10.87 24.6,10.65 24.28,10.65 v24.01,10.38 23.9,10.38 23.09,9.57 23.09,8.66 23.24,8.51 U20.6
  Bottom 0.127: U26.M6 | U26.M6 23.96,8.27 23.96,10.33 v24.01,10.38
ICE_STM_SPI_CS_  (via drill 0.25)
  Top 0.127: U21.6 17.64,7 17.8,6.84 18.07,6.84 18.88,6.03 19.82,6.03 20.75,6.97 22.98,6.97 23.53,6.42 26.63,6.42 27.09,6.88 27.09,10.88 v26.1,11.87 v26.09,11.87 26.06,11.87 24.81,13.12 24.81,13.93 U19.K10
  Bottom 0.127: U26.R10 26.37,9.89 26.8,10.31 26.8,11.17 v26.09,11.87
ICE_STM_SPI_D0  (via drill 0.25)
  Top 0.127: v22.77,12.12 v22.78,12.12 U19.L8
  Bottom 0.127: v22.77,12.12 22.74,12.09 22.74,11.39 23.18,10.96 23.18,10.24 23.3,10.12 23.3,9.73 23.31,9.72 23.31,8.45 23.12,8.27 22.86,8.27 22.66,8.07 22.66,7.79 22.48,7.61 22.19,7.61 21.86,7.28 U26.L3
ICE_STM_SPI_D1  (via drill 0.25)
  Top 0.127: U19.L7 22.04,13.5 22.04,10.82 v21.82,10.6
  Bottom 0.127: U26.L2 21.03,7.49 21.36,7.81 21.36,8.08 21.55,8.27 21.83,8.27 22,8.44 22,10.42 v21.82,10.6
ICE_STM_SPI_D2  (via drill 0.25)
  Top 0.127: v21.11,10.89 20.78,11.22 20.78,13.97 U19.K6
  Bottom 0.127: v21.11,10.89 21.35,10.65 21.35,8.46 21.16,8.27 20.91,8.27 20.7,8.05 20.7,6.95 U26.K1 | U26.K1
ICE_STM_SPI_D3  (via drill 0.25)
  Top 0.127: U19.K7 22.34,14 22.34,12.32 22.33,12.3 22.33,11.11 v22.72,10.72
  Bottom 0.127: U26.K2 21.35,6.96 21.35,7.42 21.55,7.62 21.83,7.62 22,7.79 22,8.06 22.2,8.26 22.47,8.26 22.65,8.44 22.65,10.66 v22.72,10.72
ICE_STM_SPI_D4  (via drill 0.25)
  Top 0.127: v25.18,10.57 25.58,10.97 26.53,10.97 26.8,10.7 26.8,7.26 26.26,6.71 23.62,6.71 23.11,7.22 22.05,7.22 21.63,7.64 21.63,8.73 21.35,9.01 U20.2 | U19.J9 24,14.75 v24,13.95
  Bottom 0.127: U26.R8 24.93,10.2 25.18,10.44 v25.18,10.57 25.18,10.66 24.43,11.41 24.43,13.52 v24,13.95
ICE_STM_SPI_D5  (via drill 0.25)
  Top 0.127: U20.5 23.38,8.01 22.83,8.56 22.83,10.13 23.17,10.46 23.17,11.62 v23.19,11.65 23.19,11.91 23.22,11.94 23.22,12.3 23.21,12.31 23.21,14 U19.K9
  Bottom 0.127: U26.P8 24.76,9.41 24.6,9.57 24.6,10.15 24.56,10.19 24.56,10.89 23.8,11.65 v23.19,11.65
ICE_STM_SPI_D6  (via drill 0.25)
  Top 0.127: v22.44,15.58 22.02,15.16 U19.J7
  Bottom 0.127: U26.P9 25.26,9.55 25.26,10.02 25.65,10.4 25.65,10.73 24.72,11.66 24.72,13.59 24.44,13.86 24.44,14.13 24.18,14.39 23.63,14.39 v22.44,15.58
ICE_STM_SPI_D7  (via drill 0.25)
  Top 0.127: v23.18,15.57 v23.18,15.56 U19.J8
  Bottom 0.127: U26.R9 25.91,10.21 25.91,10.84 25.03,11.71 25.03,13.94 23.41,15.57 v23.18,15.57
ICE_STM_SPI_D_READY  (via drill 0.25)
  Top 0.127: U19.L5 v20.38,10.89 | v20.38,10.89
  Bottom 0.127: v20.38,10.89 20.38,10.87 21.03,10.22 U26.R2
IMG_CLK16MHZ  (via drill 0.25)
  Top 0.127: U23.D7 33.12,19.64 33.12,20.27 v32.78,20.6
  Bottom 0.127: v32.78,20.6 32.58,20.8 U22.4
IMG_D0  (via drill 0.25)
  Top 0.127: v35.72,18.98 U23.G6 | U19.D9 23.58,19.19 v23.95,19.56
  Bottom 0.127: v23.95,19.56 24.4,19.11 25.16,19.11 26.16,20.1 31.24,20.1 31.8,19.54 35.17,19.54 v35.72,18.98
IMG_D1  (via drill 0.25)
  Top 0.127: U19.D10 24.78,18.75 25.44,18.75 v25.93,19.25 | v35.72,18.33 | v35.72,18.33 U23.G5
  Bottom 0.127: v25.93,19.25 25.93,19.28 26.5,19.85 31.12,19.85 31.69,19.28 34.77,19.28 v35.72,18.33
IMG_D2  (via drill 0.25)
  Top 0.127: U19.G11 25.21,16.8 v25.69,16.8 | U23.H4 v35.73,17.68
  Bottom 0.127: v25.69,16.8 25.72,16.76 30.07,16.76 30.69,16.14 31.17,16.14 31.58,16.55 32.09,16.55 arc90 32.29,16.75 arc-90 32.51,16.97 32.58,16.97 arc-90 32.8,16.75 arc90 33,16.55 33.2,16.55 33.21,16.56 arc90 33.43,16.79 33.43,16.77 arc-90 33.64,16.98 34.85,16.98 arc-45 35.08,16.88 arc45 35.29,16.8 35.42,16.8 arc45 35.9,17 35.92,17.01 arc45 36,17.21 arc45 35.86,17.55 v35.73,17.68
IMG_D3  (via drill 0.25)
  Top 0.127: U19.G9 23.61,16.76 v23.99,16.38 | U23.G4 v35.07,17.68
  Bottom 0.127: v35.07,17.68 35.07,17.66 34.64,17.23 31.89,17.23 31.11,16.44 30.76,16.44 30.18,17.02 27.21,17.02 26.98,17.25 24.86,17.25 v23.99,16.38
IMG_D4  (via drill 0.25)
  Top 0.127: v23.97,18.71 23.93,18.71 U19.E9 | v35.07,18.34 v35.07,18.33 U23.F5
  Bottom 0.127: v23.97,18.71 24.01,18.75 26.67,18.75 27.56,17.86 31.39,17.86 32.56,19.03 33.43,19.03 34.12,18.34 v35.07,18.34
IMG_D5  (via drill 0.25)
  Top 0.127: v28.59,13.4 28.59,13.41 27.45,14.55 25.37,14.55 U19.K11 | U23.G3 v35.72,16.39 v35.72,16.38
  Bottom 0.127: v28.59,13.4 28.72,13.27 32.77,13.27 34.74,15.24 34.74,15.4 v35.72,16.38
IMG_D6  (via drill 0.25)
  Top 0.127: U19.F9 23.58,17.62 v23.98,18.02 | U23.F4 v34.42,17.68
  Bottom 0.127: v34.42,17.68 33.33,18.77 32.67,18.77 31.5,17.6 27.44,17.6 26.56,18.48 24.67,18.48 arc90 24.44,18.25 arc-90 24.22,18.02 v23.98,18.02
IMG_D7  (via drill 0.25)
  Top 0.127: U19.G8 v23.18,17.17 | v33.12,17.68 v33.13,17.67 33.77,17.67 34.09,17.36 U23.E4
  Bottom 0.127: v23.18,17.17 23.57,17.57 24.82,17.57 arc90 25,17.75 25,18 arc-90 25.23,18.22 25.26,18.22 arc-90 25.48,18 25.48,17.75 arc90 25.7,17.53 27.06,17.53 27.24,17.35 31.62,17.35 31.95,17.68 v33.12,17.68
IMG_D8  (via drill 0.25)
  Top 0.127: v24.82,14.79 24.45,15.16 U19.J10 | U23.F3 v35.07,16.38
  Bottom 0.127: v24.82,14.79 25.08,14.53 27.87,14.53 28.09,14.74 30.41,14.74 30.85,14.3 33.4,14.3 34.48,15.38 34.48,15.78 v35.07,16.38
IMG_D9  (via drill 0.25)
  Top 0.127: U19.J11 25.64,15.16 v25.8,15.01 | U23.E3 v34.42,16.38
  Bottom 0.127: v34.42,16.38 34.22,16.17 34.22,15.49 33.29,14.57 30.94,14.57 30.46,15.04 29.05,15.04 arc-90 28.82,15.28 28.82,15.8 arc90 28.59,16.03 28.55,16.03 arc90 28.33,15.8 28.33,15.22 arc-90 28.12,15.01 v25.8,15.01
IMG_D10  (via drill 0.25)
  Top 0.127: U19.H11 25.21,15.93 v26.28,15.93 v26.28,15.94 | U23.D3 v33.77,16.38
  Bottom 0.127: v33.77,16.38 33.69,16.3 31.7,16.3 31.28,15.88 30.57,15.88 29.95,16.51 28.3,16.51 arc90 28.08,16.29 28.08,15.72 arc-90 27.86,15.5 27.83,15.5 arc-90 27.6,15.72 27.6,16.29 arc90 27.38,16.51 27.35,16.51 arc90 27.13,16.29 27.13,15.72 arc-90 26.91,15.5 26.88,15.5 arc-90 26.66,15.72 26.66,15.78 arc90 26.5,15.94 v26.28,15.94
IMG_D11
  Top 0.127: U19.H10 24.81,15.52 25.02,15.52 25.06,15.56 25.3,15.56 25.4,15.46 26.36,15.46 arc-90 26.53,15.3 26.53,15.04 arc90 26.75,14.82 26.76,14.82 arc90 26.98,15.04 26.98,15.3 arc-90 27.2,15.52 27.77,15.52 28.98,14.31 33.47,14.31 34.42,15.26 34.42,15.73 34.1,16.05 U23.E2
IMG_DCLK  (via drill 0.25)
  Top 0.127: U19.F11 25.22,17.52 28.98,17.52 30.1,16.4 v30.1,15.66 | U23.E1 v33.77,15.73
  Bottom 0.127: v33.77,15.73 33.59,15.55 arc-90 33.37,15.78 33.37,15.82 arc90 33.14,16.04 32.97,16.04 arc90 32.67,15.74 32.67,15.2 arc-90 32.48,15.01 arc-90 32.27,15.22 32.27,15.87 arc90 32.1,16.04 32.03,16.04 arc90 31.81,15.82 31.81,15.78 arc-90 31.59,15.55 30.21,15.55 v30.1,15.66
IMG_FV
  Top 0.127: U19.E11 25.91,18.36 arc45 26.16,18.47 arc45 26.38,18.99 26.38,19.26 arc-45 26.45,19.42 arc-45 26.55,19.47 arc-45 26.66,19.42 arc-45 26.73,19.26 26.73,19.1 arc45 26.88,18.74 arc45 27.11,18.64 27.52,18.64 arc45 27.75,18.74 arc45 27.91,19.11 27.91,20.09 arc-90 28.09,20.27 arc-90 28.26,20.09 28.26,18.37 arc90 28.59,18.04 30.41,18.04 30.77,17.68 31.64,17.68 31.82,17.5 31.82,17.23 32.15,16.91 U23.B3
IMG_LV
  Top 0.127: U23.C3 32.6,16.71 32.28,16.38 31.25,16.38 arc90 31.09,16.22 arc-90 30.87,16 30.73,16 arc-90 30.42,16.32 30.42,16.45 30.19,16.68 arc-90 30.19,17.33 arc90 30.19,17.65 30.14,17.69 arc90 29.83,17.69 arc-90 29.52,17.69 29.42,17.78 28.01,17.78 arc-90 27.55,18.24 27.55,18.25 arc90 27.41,18.39 27.38,18.39 arc90 27.21,18.22 27.21,17.99 arc-90 27.01,17.79 arc-90 26.81,17.98 26.81,18.32 arc90 26.62,18.51 arc90 26.44,18.34 26.44,17.9 arc-90 26.33,17.79 26.2,17.79 arc-90 26.07,17.91 26.07,17.95 arc90 25.92,18.11 25.85,18.11 arc90 25.74,18 arc-90 25.67,17.93 24.81,17.93 U19.E10
IMG_RST_  (via drill 0.25)
  Top 0.127: U19.D11 25.71,19.69 26.39,19.69 27.99,21.29 28.7,21.29 | 28.7,21.29 29.45,21.29 29.84,20.9 31.86,20.9 U23.C8 | v28.79,20.77 28.7,20.86 28.7,21.29
  Bottom 0.127: R28.1 28.83,20.73 v28.79,20.77
IMG_SCLK
  Top 0.127: U19.G10 24.78,16.35 26.07,16.35 26.2,16.48 27.2,16.48 29.12,14.57 33.31,14.57 33.55,14.81 33.55,15.3 U23.D1
IMG_SDATA
  Top 0.127: U23.B2 31.82,15.73 31.09,15.73 30.34,14.98 29.31,14.98 28.48,15.81 28.48,16.89 | 28.48,16.89 28.12,17.25 25.38,17.25 25.33,17.2 25.03,17.2 24.66,17.56 U19.F10 | R29.2 28.48,16.89
LED_SEL  (via drill 0.25)
  Top 0.127: U14.11 9.3,3.04 9.02,3.32 8.61,3.32 v8.38,3.56 | U16.6 36.15,27.38 36.57,27.8 36.57,30.41 35.52,31.46 | 35.52,31.46 34.8,32.18 20.87,32.18 v20.07,31.37 | 35.52,31.46 35.77,31.71 v35.86,31.71
  Bottom 0.127: v8.38,3.56 8.18,3.76 8.18,3.94 7.55,4.57 6.1,4.57 5.84,4.83 5.84,5.08 3.91,7.01 3.91,10.26 6.79,13.14 6.79,29.9 8.64,31.75 19.69,31.75 v20.07,31.37 | U17.6 35.69,31.71 v35.86,31.71
LED_SIGNAL  (via drill 0.25)
  Top 0.127: v9.1,5.08 9.24,4.94 9.24,4.85 9.54,4.54 U14.8 | U16.1 36.16,29.16 36.16,30.45 34.68,31.92 31.04,31.92 | v19.3,30.99 19.38,30.91 20.28,30.91 21.29,31.92 31.04,31.92 | v32.13,30.3 31.52,30.92 31.52,31.45 31.04,31.92
  Bottom 0.127: v9.1,5.08 6.84,5.08 6.47,5.46 5.97,5.46 4.17,7.26 4.17,10.16 7.11,13.1 7.11,29.72 8.89,31.5 18.8,31.5 v19.3,30.99 | U17.3 33.06,28.52 32.12,29.46 v32.12,30.3 v32.13,30.3
MOTION_EN_  (via drill 0.25)
  Top 0.127: v4.15,12.28 4.36,12.06 4.36,10.08 4.08,9.8 4.08,5.49 3.91,5.32 3.91,4.11 4.71,3.31 7.87,3.31 8.11,3.07 8.91,3.07 9.44,2.55 U14.12
  Bottom 0.127: Q4.G 3.05,18.75 4.17,17.62 4.17,12.3 v4.15,12.28
MOTION_SIGNAL  (via drill 0.25)
  Top 0.127: v3.15,11.58 3.15,10.68 3.57,10.26 3.57,5.71 3.37,5.5 3.37,1.44 4.2,0.61 10.56,0.61 11.4,1.46 U14.15
  Bottom 0.127: v3.15,11.58 3.17,11.57 4.1,11.57 5.7,13.17 U18.2
MSP_RST_  (via drill 0.25)
  Top 0.127: v12.87,6.36 12.9,6.32 U14.1
  Bottom 0.127: U26.B8 24.93,1.41 24.64,1.12 23.49,1.12 23.3,1.3 23.3,1.57 23.12,1.76 22.84,1.76 22.65,1.96 22.65,2.88 22.45,3.07 21.55,3.07 21.36,3.26 21.36,3.5 21.16,3.7 18.64,3.7 18.24,3.3 17.06,3.3 16.56,3.81 C21.1 15.18,3.81 14.76,3.39 13.49,3.39 13.04,3.83 13.04,5.96 12.87,6.14 v12.87,6.36
MSP_STM_I2C_SCL  (via drill 0.25)
  Top 0.127: U14.10 9.31,3.54 v9.08,3.77
  Bottom 0.127: v9.08,3.77 9.96,3.77 12.5,1.23 12.5,1.06 13.09,0.47 18.8,0.47 | U26.A5 22.78,0.79 22.46,0.47 18.8,0.47 | R37.1 19.06,0.73 18.8,0.47
MSP_STM_I2C_SDA  (via drill 0.25)
  Top 0.127: U14.9 9.51,4.04 9.27,4.28 9.17,4.28 v9.06,4.39
  Bottom 0.127: v9.06,4.39 11.34,4.39 13.11,2.62 16.65,2.62 16.91,2.36 18.39,2.36 18.91,1.85 | R38.1 18.91,1.85 | 18.91,1.85 19.52,1.85 20.25,1.12 21.81,1.12 22.13,1.44 U26.B4
MSP_TEST  (via drill 0.25)
  Top 0.127: U14.2 12.4,6.2 v12.25,6.35
  Bottom 0.127: U26.B9 25.26,1.11 25.26,0.65 25.08,0.47 23.49,0.47 23.31,0.66 23.31,0.93 23.13,1.12 22.85,1.12 22.66,1.31 22.66,1.58 22.49,1.75 20.22,1.75 20.05,1.92 20.05,2.04 19,3.09 18.67,3.09 18.62,3.04 16.96,3.04 16.86,3.13 13.35,3.13 12.79,3.69 12.79,5.79 12.25,6.33 v12.25,6.35
MSP_XIN
  Top 0.254: U14.22 arc45 14.36,4.37 X1.2
  Top 0.508: C17.1 15.03,5.27 X1.2
MSP_XOUT
  Top 0.254: U14.21 arc-45 14.36,3.21 X1.1
  Top 0.508: C18.1 15.03,2.32 X1.1
N$1
  pour Top (rank 2, no thermals): 38.35,30.18 38.35,29.21 37.59,29.21 37.59,28.96 39.12,28.96 39.12,28.07 41.41,28.07 41.41,30.18
N$2  (via drill 0.25)
  other vias: 26.35,7.45
  pour Bottom (no thermals): 26.03,7.22 26.03,8.03 26.52,8.03 26.52,7.22
  pour Top (no thermals): 25.34,7.62 25.34,7.03 26.52,7.03 26.52,7.62
N$3
  pour Top (rank 2, no thermals): 4.08,24.67 5.3,24.67 5.3,23.7 6.64,23.7 6.64,26.42 5.03,26.42 5.03,27.66 4.57,27.66 4.57,27.48 4.88,27.48 4.88,26.15 4.08,26.15
N$4
  Top 0.127: U25.4 14.37,11.62 14.37,12.33 Q6.G
N$5
  Top 0.127: U16.4 33.92,28.13 LED1.A
N$6  (via drill 0.25)
  Top 0.127: LED2.A 33.2,29.15 32.59,29.75 v32.57,29.73
  Bottom 0.127: U17.4 33.15,30.31 v32.57,29.73
N$7  (via drill 0.25)
  other vias: 27.86,3.72
  pour Bottom (rank 2, no thermals): 28.14,4.18 27.71,3.83 27.67,3.6 27.89,3.43 28.02,3.48 28.31,4.04
  pour Top (no thermals): 27.7,3.91 27.7,2.7 28.83,2.7 28.83,3.46 28.09,3.46 28.09,3.91
N$8
  pour Bottom (no thermals): 6.24,21.64 4.56,21.64 4.56,18.53 6.24,18.53
N$10  (via drill 0.25)
  Top 0.127: v29.16,5.67 29.67,6.17 31.19,6.17 31.59,6.57 R41.2
  Bottom 0.127: U26.J15 v29.16,5.67 | v29.16,5.67
N$11
  Top 0.127: Q1.3 28.95,29.5 29.39,29.06 30.21,29.06 R6.1
N$12
  Top 0.127: R6.2 30.75,27.66 U3.4
N$13
  pour Bottom (rank 2, no thermals): 29.43,29.72 29.43,29.21 29.69,29.21 29.69,26.92 30.12,26.92 30.12,26.16 31.71,26.16 31.71,30.23 30.19,30.23 30.19,29.72
N$15
  pour Top (no thermals): 27.44,26.37 27.44,25.61 26.07,25.61 26.07,23.83 27.69,23.83 27.69,26.37
N$16
  Top 0.127: LED2.C 33.17,27.76 33.77,27.16 R20.2
N$17
  pour Bottom (no thermals): 33.76,9.29 33.76,10.14 31.73,10.14 31.73,9.63 32.68,9.63 32.68,9.29
N$18
  Top 0.127: R15.1 26.32,27.96 | 26.32,27.96 26.65,27.96 26.84,28.16 27.27,28.16 27.57,27.86 U8.5 | R14.2 R15.1 26.32,27.96
N$19
  pour Top (no thermals): 24.29,26.99 24.29,22.92 24.93,22.92 24.93,25.86 26.57,25.86 26.57,26.48 25.81,26.48 25.81,26.99
N$21
  Bottom 0.127: R7.2 38.76,17.29 U4.5
N$22
  pour Bottom (rank 2, no thermals): 28.29,29.72 28.29,28.87 27.99,28.87 27.99,27.1 29.18,27.1 29.18,28.86 28.52,28.86 28.52,29.72
N$23
  Bottom 0.127: LED3.C 42.67,24.42 R21.1
N$24
  pour Bottom (rank 2, no thermals): 23.34,25.65 26.03,25.65 26.03,25.35 25.11,25.35 25.11,24.64 23.34,24.64
N$25  (via drill 0.25)
  other vias: 29.16,6.32
  pour Bottom (rank 2, no thermals): 28.79,5.9 28.79,6.03 28.78,6.52 29.36,6.52 29.36,5.9
  pour Top (no thermals): 28.93,6.6 28.93,6.1 30.18,6.1 30.18,6.98 29.57,6.98 29.57,6.6
N$28
  Bottom 0.127: LED4.C 41.79,24.4 R22.1
N$30
  Bottom 0.127: LED6.C R40.1
N$31
  Bottom 0.127: LED5.C R39.1
N$32
  Top 0.127: Q2.3 37.84,29.86 37.39,29.41 37.39,28.7 37.73,28.36 Q3.5
  pour Top (no thermals): 39.91,28.48 36.88,28.48 36.88,27.59 39.91,27.59
N$33
  Bottom 0.127: R16.2 29.34,30.68 29.34,31.23 28.82,31.76 R17.1 28.42,31.43 U9.5
N$34
  Bottom 0.127: U7.5 27.21,25.44 27.82,25.44 R13.1 28.11,25.1 R12.2
N$35  (via drill 0.25)
  Top 0.127: J10.A5 36.84,5 v36.74,4.9
  Bottom 0.127: R42.1 37.24,4.4 v36.74,4.9
N$36  (via drill 0.25)
  Top 0.127: J10.B5 36.7,8 36.58,8.13 v36.32,8.13
  Bottom 0.127: R43.1 35.94,7.84 36.23,8.13 v36.32,8.13
N$38
  Bottom 0.127: C7.1 26.04,23.36 26.75,24.07 27.11,24.07 R12.1
  pour Bottom (rank 2, no thermals): 23.13,23.98 23.13,22 26.64,22 26.64,23.98
N$40
  Top 0.127: U21.4 17.64,10.1 18.28,10.74 19.9,10.74 20.95,9.7 U20.1
N$42
  Bottom 0.127: U1.4 35.59,24.59 R4.1 35.42,24.41 R2.2
N$43
  pour Top (rank 2, no thermals): 31.02,31.34 27.89,31.34 27.89,30.73 28.78,30.73 28.78,29.91 31.02,29.91
N$45
  Top 0.127: R18.2 34.03,30.5 | LED1.C 34.18,29.86 34.18,30.5 34.03,30.5 | R19.2 33.31,30.5 34.03,30.5
N$54  (via drill 0.38)
  Top 0.381: v36.78,8.63 36.8,8.65 J10.A9B4
  Bottom 0.381: v36.78,8.63 37.09,8.63 38.09,7.62 FB1.1 38.09,4.16 v39.12,3.13
  pour Bottom (no thermals): 37.3,6.68 37.3,5.35 38.42,5.35 38.42,6.68
  pour Top (no thermals): 37.34,4.06 39.62,4.06 39.62,2.79 38.59,2.79 38.59,3.56 37.34,3.56
NIL
  cutout Top (no thermals): 13.79,1.25 17.6,1.25 17.6,6.3 13.79,6.3
  cutout Bottom (no thermals): 32.77,7.2 32.77,6.6 34.54,6.6 34.54,7.2
RAM_A0  (via drill 0.25)
  Top 0.127: U19.D5 20.02,19.52 v20.02,19.56 | U24.H7 v15.71,25.91
  Bottom 0.127: v15.71,25.91 19.17,22.45 19.17,21.03 19.4,20.81 19.49,20.81 20.02,20.28 v20.02,19.56
RAM_A1
  Top 0.127: U19.B3 18.35,21.2 18.35,25.92 17.3,26.97 16.73,26.97 16.29,26.52 16.29,25.97 U24.H8
RAM_A2
  Top 0.127: U19.B2 17.59,21.15 17.59,21.7 17.32,21.97 16.69,21.97 15.55,23.11 14.99,23.11 14.31,23.79 14.31,24.09 14.51,24.28 15.06,24.28 15.98,23.37 16.42,23.37 16.84,23.78 U24.J8
RAM_A3
  Top 0.127: U24.J7 15.55,24.81 15.28,24.54 14.79,24.54 13.24,26.1 12.61,26.1 12.41,25.9 12.41,25.32 14.91,22.81 15.49,22.81 16.74,21.56 U19.A1
RAM_A4
  Top 0.127: U24.J3 15.21,22.56 arc-90 15.21,22.27 14.24,21.31 arc90 14.24,20.99 14.24,20.99 arc90 14.56,20.99 15.56,22 arc-90 15.84,22 15.84,21.99 arc-90 15.84,21.68 14.84,20.68 arc90 14.84,20.36 14.84,20.36 arc90 15.15,20.36 16.16,21.36 arc-90 16.58,21.36 U19.B1
RAM_A5
  Top 0.127: U19.C2 17.73,19.96 17.3,20.39 15.75,20.39 15.06,19.7 15.06,18.18 arc-90 14.89,18.02 14.7,18.02 arc-90 14.47,18.24 14.47,20.35 13.92,20.91 13.92,21.77 13.69,21.99 U24.J2
RAM_A6  (via drill 0.25)
  Top 0.127: U24.H3 12.89,23.12 v12.87,23.11 | U19.C4 19.21,20.34 v19.21,20.37
  Bottom 0.127: v12.87,23.11 13.51,23.11 15.62,20.99 18.59,20.99 v19.21,20.37
RAM_A7
  Top 0.127: U24.H2 12.31,22.55 11.9,22.15 11.9,21.7 13.83,19.77 13.83,17.82 14.16,17.48 15.32,17.48 15.67,17.83 15.67,19.46 16.09,19.88 16.69,19.88 17.04,19.53 17.61,19.53 U19.D2 | U19.D2
RAM_A8
  Top 0.127: U19.C1 17.01,20.14 15.97,20.14 15.4,19.56 15.4,18.18 arc-90 14.96,17.74 14.53,17.74 arc-90 14.09,18.17 14.09,20.36 13.66,20.79 13.66,21.23 12.74,22.15 12.46,22.15 U24.H1
RAM_A9  (via drill 0.25)
  Top 0.127: v12.36,23.73 12.4,23.69 U24.G3 | v18.38,20.44 18.78,20.04 U19.C3
  Bottom 0.127: v18.38,20.44 18.34,20.48 15.76,20.48 14.15,22.09 13.24,22.09 12.43,22.91 12.43,23.66 v12.36,23.73
RAM_A10
  Top 0.127: U24.H9 17.38,26.52 17.98,25.92 17.98,25.3 arc-90 17.76,25.07 17.38,25.07 arc90 17.16,24.85 17.16,24.77 arc90 17.38,24.55 17.76,24.55 arc-90 17.98,24.33 17.98,24.25 arc-90 17.76,24.03 17.38,24.03 arc90 17.16,23.81 17.16,23.73 arc90 17.38,23.51 17.76,23.51 arc-90 17.98,23.29 17.98,23.21 arc-90 17.76,22.99 17.38,22.99 arc90 17.16,22.77 17.16,22.69 arc90 17.38,22.47 17.76,22.47 arc-90 17.98,22.25 U19.A2
RAM_A11  (via drill 0.25)
  Top 0.127: v11.71,23.09 11.75,23.12 U24.G2 | v16.19,19.36 16.39,19.16 U19.D1
  Bottom 0.127: v16.19,19.36 16.16,19.36 13.94,21.58 12.89,21.58 11.72,22.75 11.72,23.07 v11.71,23.09
RAM_BA0  (via drill 0.25)
  Top 0.127: U24.G7 v15.14,26.48 | U19.C7 22.32,20.3 v22.32,20.36
  Bottom 0.127: v15.14,26.48 15.78,26.48 16.36,25.9 16.36,25.7 16.64,25.42 20.18,25.42 22.55,23.06 22.55,20.64 22.32,20.41 v22.32,20.36
RAM_BA1
  Top 0.127: U19.B4 19.16,21.19 19.16,25.84 17.52,27.47 16.11,27.47 15.71,27.07 U24.G8
RAM_CAS_  (via drill 0.25)
  Top 0.127: U24.F7 v14.58,27.04 | U19.D7 v22.37,19.55 v22.37,19.56
  Bottom 0.127: v22.37,19.56 22.37,19.74 22.84,20.21 22.84,23.13 18.93,27.04 v14.58,27.04
RAM_CKE  (via drill 0.25)
  Top 0.127: U19.D3 18.69,19.16 v18.38,19.48 | U24.F3 12.29,24.24 v11.75,24.24
  Bottom 0.127: v11.75,24.24 11.75,23.68 12.17,23.26 12.17,22.75 13.08,21.84 14.04,21.84 15.88,20 17.86,20 v18.38,19.48
RAM_CLK
  Top 0.127: U19.E1 16.26,18.36 16.07,18.17 16.07,17.87 15.43,17.23 14.06,17.23 13.57,17.71 13.57,19.54 10.77,22.35 10.77,23.25 11.2,23.69 U24.F2
RAM_CS_
  Top 0.127: U24.G9 16.41,27.22 17.42,27.22 18.78,25.86 U19.A3
RAM_DQ0
  Top 0.127: U19.A9 23.52,21.62 23.52,25.45 17.74,31.23 13.08,31.23 12.31,30.46 U24.A8
RAM_DQ1
  Top 0.127: U19.A8 22.78,22.78 23.01,23.01 23.01,25.24 18.25,30 13.53,30 U24.B9
RAM_DQ2
  Top 0.127: U19.B9 23.58,21.04 23.21,21.41 23.21,22.68 23.27,22.74 23.27,25.35 18.3,30.32 13.28,30.32 12.88,29.92 U24.B8
RAM_DQ3
  Top 0.127: U19.A7 21.98,23.3 22.32,23.65 22.32,25.2 18.08,29.44 14.1,29.44 U24.C9
RAM_DQ4
  Top 0.127: U19.B8 22.78,20.97 22.41,21.34 22.41,22.77 22.75,23.11 22.75,25.14 18.16,29.73 13.85,29.73 13.57,29.46 13.57,28.91 U24.C8
RAM_DQ5
  Top 0.127: U24.D9 14.72,28.93 17.87,28.93 21.58,25.22 21.58,23.69 21.18,23.28 U19.A6
RAM_DQ6
  Top 0.127: U19.B7 21.98,21.03 21.61,21.4 21.61,23.29 21.91,23.59 21.91,25.26 17.98,29.18 14.43,29.18 14.01,28.77 U24.D8
RAM_DQ7
  Top 0.127: U19.A5 20.29,21.65 20.29,25.79 17.7,28.37 15.31,28.37 15.16,28.22 U24.E9
RAM_DQ8  (via drill 0.25)
  Top 0.127: U24.E1 v10.62,24.2 v10.62,24.21 | v17.62,17.94 17.98,17.58 U19.F2
  Bottom 0.127: v10.62,24.21 10.66,24.18 10.66,22.34 14.73,18.26 17.3,18.26 v17.62,17.94
RAM_DQ9  (via drill 0.25)
  Top 0.127: U19.G2 17.98,16.81 v17.6,17.19 | U24.D2 v10.04,24.82
  Bottom 0.127: v17.6,17.19 17.43,17.36 14.92,17.36 9.63,22.64 9.63,23.87 10.04,24.28 v10.04,24.82
RAM_DQ10  (via drill 0.25)
  Top 0.127: U19.F1 16.93,17.81 v16.57,17.81 | U24.D1 10.08,24.22 v10.08,23.67
  Bottom 0.127: v10.08,23.67 10.4,23.35 10.4,22.23 14.83,17.81 v16.57,17.81
RAM_DQ11  (via drill 0.25)
  Top 0.127: U24.C2 10.02,25.36 v9.53,25.36 | U19.H2 17.93,15.96 v17.57,16.33
  Bottom 0.127: v9.53,25.36 9.53,25.09 8.78,24.34 8.78,22.77 15.07,16.49 15.84,16.49 15.9,16.54 16.36,16.54 16.44,16.46 16.81,16.46 16.83,16.49 17.41,16.49 v17.57,16.33
RAM_DQ12  (via drill 0.25)
  Top 0.127: U19.G1 16.77,16.76 v16.62,16.91 | U24.C1 9.23,24.57 v9.23,24.15